# Altium schematic sheet Power_Circuit.SchDoc
size A; SheetNumber: 3; SheetTotal: 3
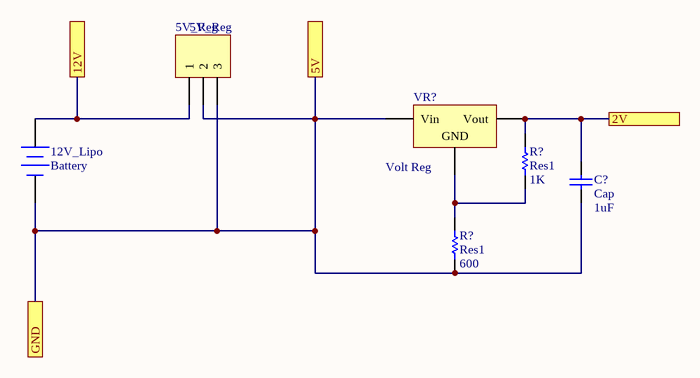
[diagram p0: Power_Circuit.SchDoc]

## Parts
(Parts that share a designator on the sheet are numbered #1, #2 ... from top to bottom, then left to right.)
5V_Reg  5V_Reg  [HDR1X3]
12V_Lipo  Battery  [BAT-2]
C?  Cap  value 1uF  [RAD-0.3]
R?#1  Res1  value 1K  [AXIAL-0.3]
R?#2  Res1  value 600  [AXIAL-0.3]
VR?  Volt Reg  [D2PAK_N]

## Ports
2V, 5V, 12V, GND

## Nets
2V: C?.2 R?#1.2 VR?.3(Vout) ; port 2V
5V: 5V_Reg.2 5V_Reg.3 12V_Lipo.2(-) C?.1 R?#2.1 VR?.1(Vin) ; port 5V, port GND
12V: 5V_Reg.1 12V_Lipo.1(+) ; port 12V
NetR?#1_1: R?#1.1 R?#2.2 VR?.2(GND)

## Library data of the parts
5V_Reg = Header 3: Header, 3-Pin; LatestRevisionDate: 17-Jul-2002; LatestRevisionNote: Re-released for DXP Platform.; Publisher: Altium Limited
12V_Lipo = Battery: 3 Cell Lipo; Published: 24-Mar-1999; LatestRevisionDate: 17-Jul-2002; LatestRevisionNote: Re-released for DXP Platform.; PackageReference: BAT-2; Publisher: Altium Limited; PackageDescription: Battery; 2 Leads
C? = Cap: Capacitor; Published: 8-Jun-2000; LatestRevisionDate: 17-Jul-2002; LatestRevisionNote: Re-released for DXP Platform.; PackageReference: RAD-0.3; Publisher: Altium Limited; PackageDescription: Radial Cap, Thru-Hole; 2 Leads; 0.3 in Pin Spacing
R?#1 R?#2 = Res1: Resistor; Published: 8-Jun-2000; LatestRevisionDate: 17-Jul-2002; LatestRevisionNote: Re-released for DXP Platform.; PackageReference: AXIAL-0.3; Publisher: Altium Limited; PackageDescription: Axial Device, Thru-Hole; 2 Leads; 0.3 in Pin Spacing
VR? = Volt Reg: Voltage Regulator; Published: 24-Mar-1999; LatestRevisionDate: 29-May-2009; LatestRevisionNote: IPC-7351 Footprint Added.; PackageReference: D2PAK; Publisher: Altium Limited; PackageDescription: 3-Pin Transistor Outline Package 2.54 mm Pitch, 15.1 mm Lead Span